# EAGLE design Esquema reloj neopixel (EAGLE 7.3.0)
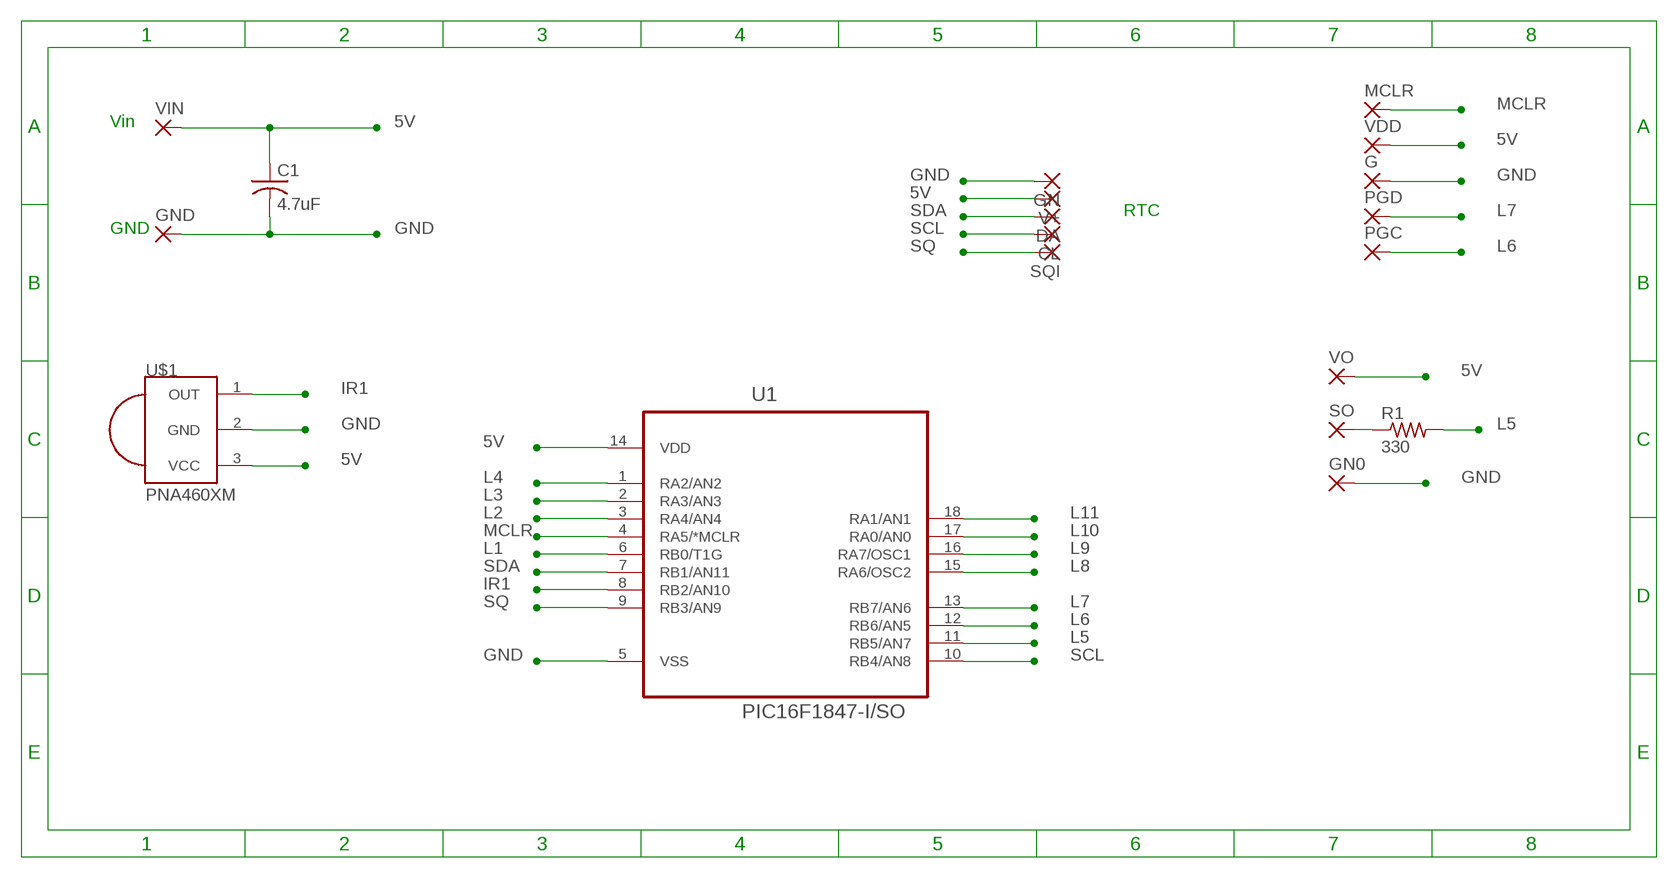
[diagram p0: schematic, sheet 1]

## Parts
C1  4.7uF  C-USC0805K  [C0805K]
CL  SMD2  [SMD1,27-2,54]
DA  SMD2  [SMD1,27-2,54]
G  SMD2  [SMD1,27-2,54]
GN  SMD2  [SMD1,27-2,54]
GN0  SMD2  [SMD1,27-2,54]
GND  SMD2  [SMD1,27-2,54]
MCLR  SMD2  [SMD1,27-2,54]
PGC  SMD2  [SMD1,27-2,54]
PGD  SMD2  [SMD1,27-2,54]
R1  330  R-US_R0805  [R0805]
SO  SMD2  [SMD1,27-2,54]
SQI  SMD2  [SMD1,27-2,54]
U1  PIC16F1847-I/SO  [SOIC127P1030X265-18N]
U$1  PNA460XM  [PNA460XM]
V+  SMD2  [SMD1,27-2,54]
VDD  SMD2  [SMD1,27-2,54]
VIN  SMD2  [SMD1,27-2,54]
VO  SMD2  [SMD1,27-2,54]

## Nets
5V: C1.1 U1.14(VDD) U$1.3(VCC) V+.1(P) VDD.1(P) VIN.1(P) VO.1(P)
GND: C1.2 G.1(P) GN0.1(P) GN.1(P) GND.1(P) U1.5(VSS) U$1.2(GND)
IR1: U1.8(RB2/AN10) U$1.1(OUT)
L1: U1.6(RB0/T1G)
L2: U1.3(RA4/AN4)
L3: U1.2(RA3/AN3)
L4: U1.1(RA2/AN2)
L5: R1.2 U1.11(RB5/AN7)
L6: PGC.1(P) U1.12(RB6/AN5)
L7: PGD.1(P) U1.13(RB7/AN6)
L8: U1.15(RA6/OSC2)
L9: U1.16(RA7/OSC1)
L10: U1.17(RA0/AN0)
L11: U1.18(RA1/AN1)
MCLR: MCLR.1(P) U1.4(RA5/*MCLR)
N$1: R1.1 SO.1(P)
SCL: CL.1(P) U1.10(RB4/AN8)
SDA: DA.1(P) U1.7(RB1/AN11)
SQ: SQI.1(P) U1.9(RB3/AN9)

## Notes on the sheet
- Vin
- RTC
- GND

## Library data of the parts
C1 = adafruit:C-US: CAPACITOR, American symbol
CL DA G GN GN0 GND MCLR PGC PGD SO SQI V+ VDD VIN VO = wirepad:SMD2: SMD PAD
R1 = adafruit:R-US_: RESISTOR, American symbol
U1 = PIC 16F1847:PIC16F1847-I/SO: IC, 18 Pin Flash Microcontrollers with XLP Technology-SOIC-18; MPN: PIC16F1847-I/SO; OC_FARNELL: 1971870; OC_NEWARK: 23T3107; PACKAGE: SOIC-18; SUPPLIER: Microchip
U$1 = adafruit:PNA460XM: IR 38KHz receiver PNA4602 and related receivers http://www.ladyada.net/library/pcb/eaglelibrary.html

## Board
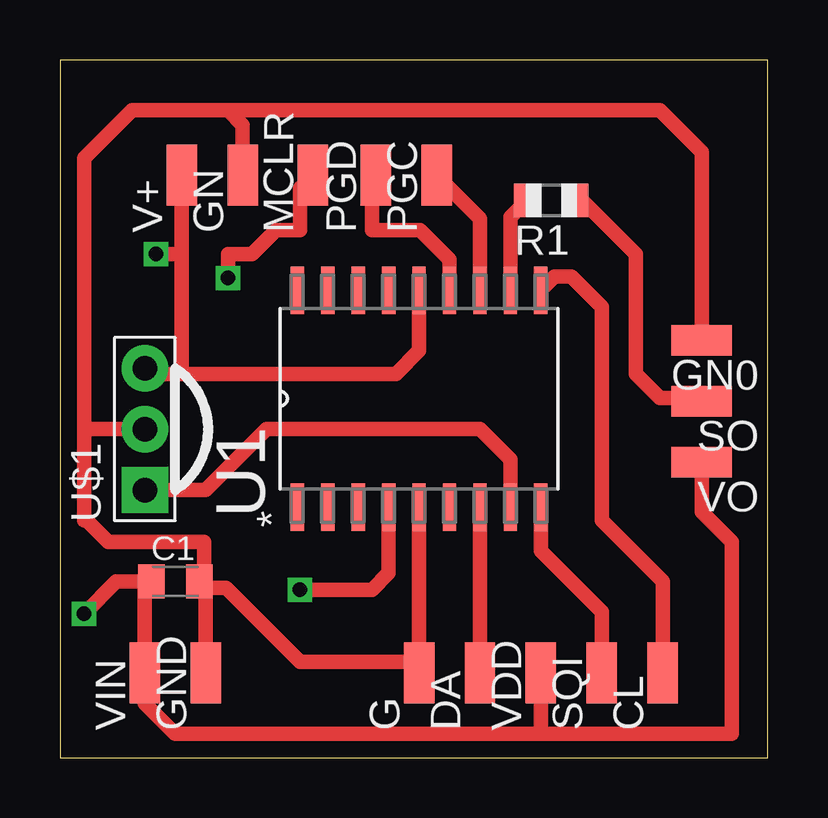
[diagram p1: board, top side]
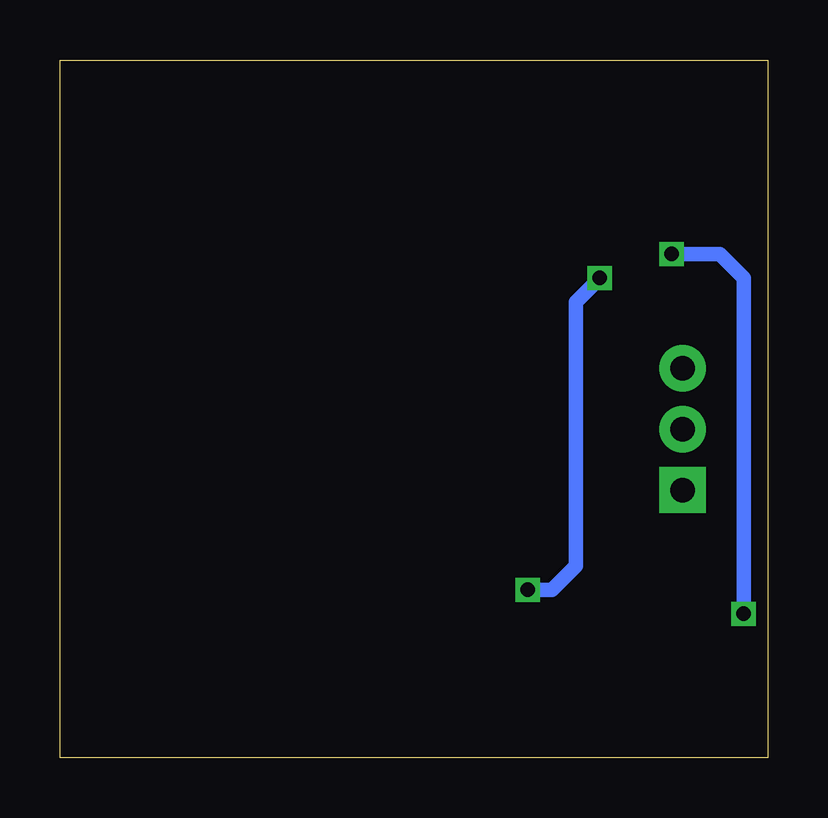
[diagram p2: board, bottom side, seen from below]

Size 29.5 x 29.09 mm. Coordinates in mm from the lower left corner, seen from the top.
Outline: 0,0 29.5,0 29.5,29.09 0,29.09 0,0
Copper layers (1*16): Top 0.035mm / dielectric 1.5mm / Bottom 0.035mm
Design rules "default": minimum track width 10mil, minimum drill 24mil, track to track 8mil, track to pad 8mil, pad to pad 8mil, via to via 8mil, smd to smd 8mil, copper to edge 40mil, drill to drill 8mil, minimum pad ring 10mil, minimum via ring 8mil, stop-mask expansion 4mil, vias tented up to drill 0mil, thermal gap 10mil

### Footprints (pad centres in the part's own frame; a part is rotated, then mirrored left to right if it is on the bottom)
C0805K = smd 1.1 x 1.4: 1 -1,0; 2 1,0
SMD1,27-2,54 = smd 1.27 x 2.54: 1 0,0
R0805 = smd 1.1 x 1.4: 1 -1,0; 2 1,0
SOIC127P1030X265-18N = smd 1.981 x 0.559: 1 -4.521,5.08; 2 -4.521,3.81; 3 -4.521,2.54; 4 -4.521,1.27; 5 -4.521,0; 6 -4.521,-1.27; 7 -4.521,-2.54; 8 -4.521,-3.81; 9 -4.521,-5.08; 10 4.521,-5.08; 11 4.521,-3.81; 12 4.521,-2.54; 13 4.521,-1.27; 14 4.521,0; 15 4.521,1.27; 16 4.521,2.54; 17 4.521,3.81; 18 4.521,5.08
PNA460XM = drill 1.016 pad 1.93 square: 1 -2.54,0 | drill 1.016 pad 1.93: 2 0,0; 3 2.54,0

### Placement (x,y rotation side)
C1  4.81,7.35 0 top
CL  25.13,3.54 0 top
DA  17.51,3.54 0 top
G  14.97,3.54 0 top
GN  7.62,24.29 0 top
GN0  26.75,17.4 90 top
GND  6.08,3.54 0 top
MCLR  10.54,24.29 0 top
PGC  15.7,24.29 0 top
PGD  13.16,24.29 0 top
R1  20.48,23.24 180 top
SO  26.75,14.86 90 top
SQI  22.59,3.54 0 top
U1  14.97,14.97 90 top
U$1  3.54,13.7 90 top
V+  5.08,24.29 0 top
VDD  20.05,3.54 0 top
VIN  3.54,3.54 0 top
VO  26.75,12.32 90 top

### Tracks (layer width: path | path; a pad name or v marks a point on that pad's centre or on a via)
5V  (via drill 0.6)
  Top 0.61: VDD.1 20.05,1 | 20.05,1 4.81,1 3.54,2.27 VIN.1 3.54,7.08 C1.1 2.35,7.35 v1,6 | U1.14 14.97,16.97 14,16 5,16 | 5,16 3.78,16 U$1.3 | V+.1 5.08,21 | 5.08,21 5.08,16.08 5,16 | VO.1 26.75,10.25 28,9 28,1 20.05,1 | v4,21 5.08,21
  Bottom 0.61: v1,6 1,20 2,21 v4,21
GND
  Top 0.61: GND.1 6.08,7.08 | 6.08,7.08 C1.2 6,7.54 6,9 2,9 1.11,9.89 1,9.89 1,13.7 | U1.5 G.1 15,3.57 15,4 10,4 6.92,7.08 6.08,7.08 | U$1.2 1,13.7 | GN.1 7.62,26.38 7,27 | 7,27 3,27 1,25 1,13.7 | GN0.1 26.75,25.25 25,27 7,27
IR1
  Top 0.61: U$1.1 6.08,11.16 8.62,13.7 17.51,13.7 18.78,12.43 U1.8
L5
  Top 0.61: U1.11 18.78,22.54 R1.2
L6
  Top 0.61: U1.12 17.51,22.48 PGC.1
L7
  Top 0.61: U1.13 16.24,20.76 15,22 13,22 13,24.13 PGD.1
MCLR  (via drill 0.6)
  Top 0.61: U1.4 13.7,7.7 13,7 v10,7 | v7,20 7,21 8,21 9,22 10,22 10,23.75 MCLR.1
  Bottom 0.61: v10,7 9,7 8,8 8,19 v7,20
N$1
  Top 0.61: R1.1 21.76,23.24 24,21 24,16 25,15 26.61,15 SO.1
SCL
  Top 0.61: CL.1 25.13,7.35 22.59,9.89 22.59,18.78 21.32,20.05 20.61,20.05 U1.10
SDA
  Top 0.61: DA.1 U1.7
SQ
  Top 0.61: SQI.1 22.59,6.08 20.05,8.62 U1.9